# Altium schematic sheet PIR.SchDoc
size A4; SheetNumber: 1; SheetTotal: 10
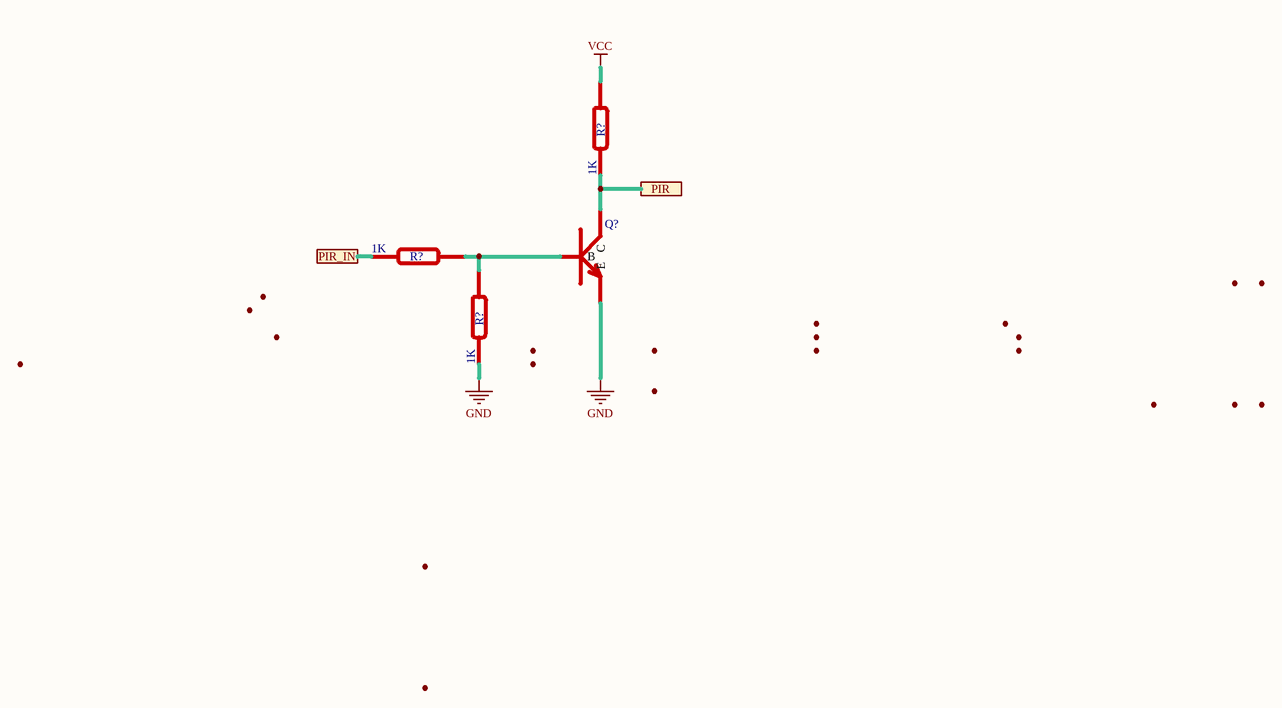
[diagram p0: PIR.SchDoc]

## Parts
(Parts that share a designator on the sheet are numbered #1, #2 ... from top to bottom, then left to right.)
Q?  S8050  [TO-92A]  (value not drawn)
R?#1  1K  [R0805]
R?#2  1K  [R0805]
R?#3  1K  [R0805]

## Ports
PIR, PIR_IN

## Nets
GND: Q?.2(E) R?#3.1
VCC: R?#1.2
PIR: Q?.3(C) R?#1.1 ; port PIR
PIR_IN: R?#2.1 ; port PIR_IN
NetQ?_1: Q?.1(B) R?#2.2 R?#3.2

## Notes on the sheet
- Title
- Size:
- Date:
- A4
- Number:
- Time:
- Revision:
- Design by:
- Company:
- File:

## Library data of the parts
Q? = S8050: NPN Transistors 0.5A Collector to Emitter 25V
R?#1-R?#3 = Resistor